# EAGLE schematic Main (EAGLE 7.5.0)
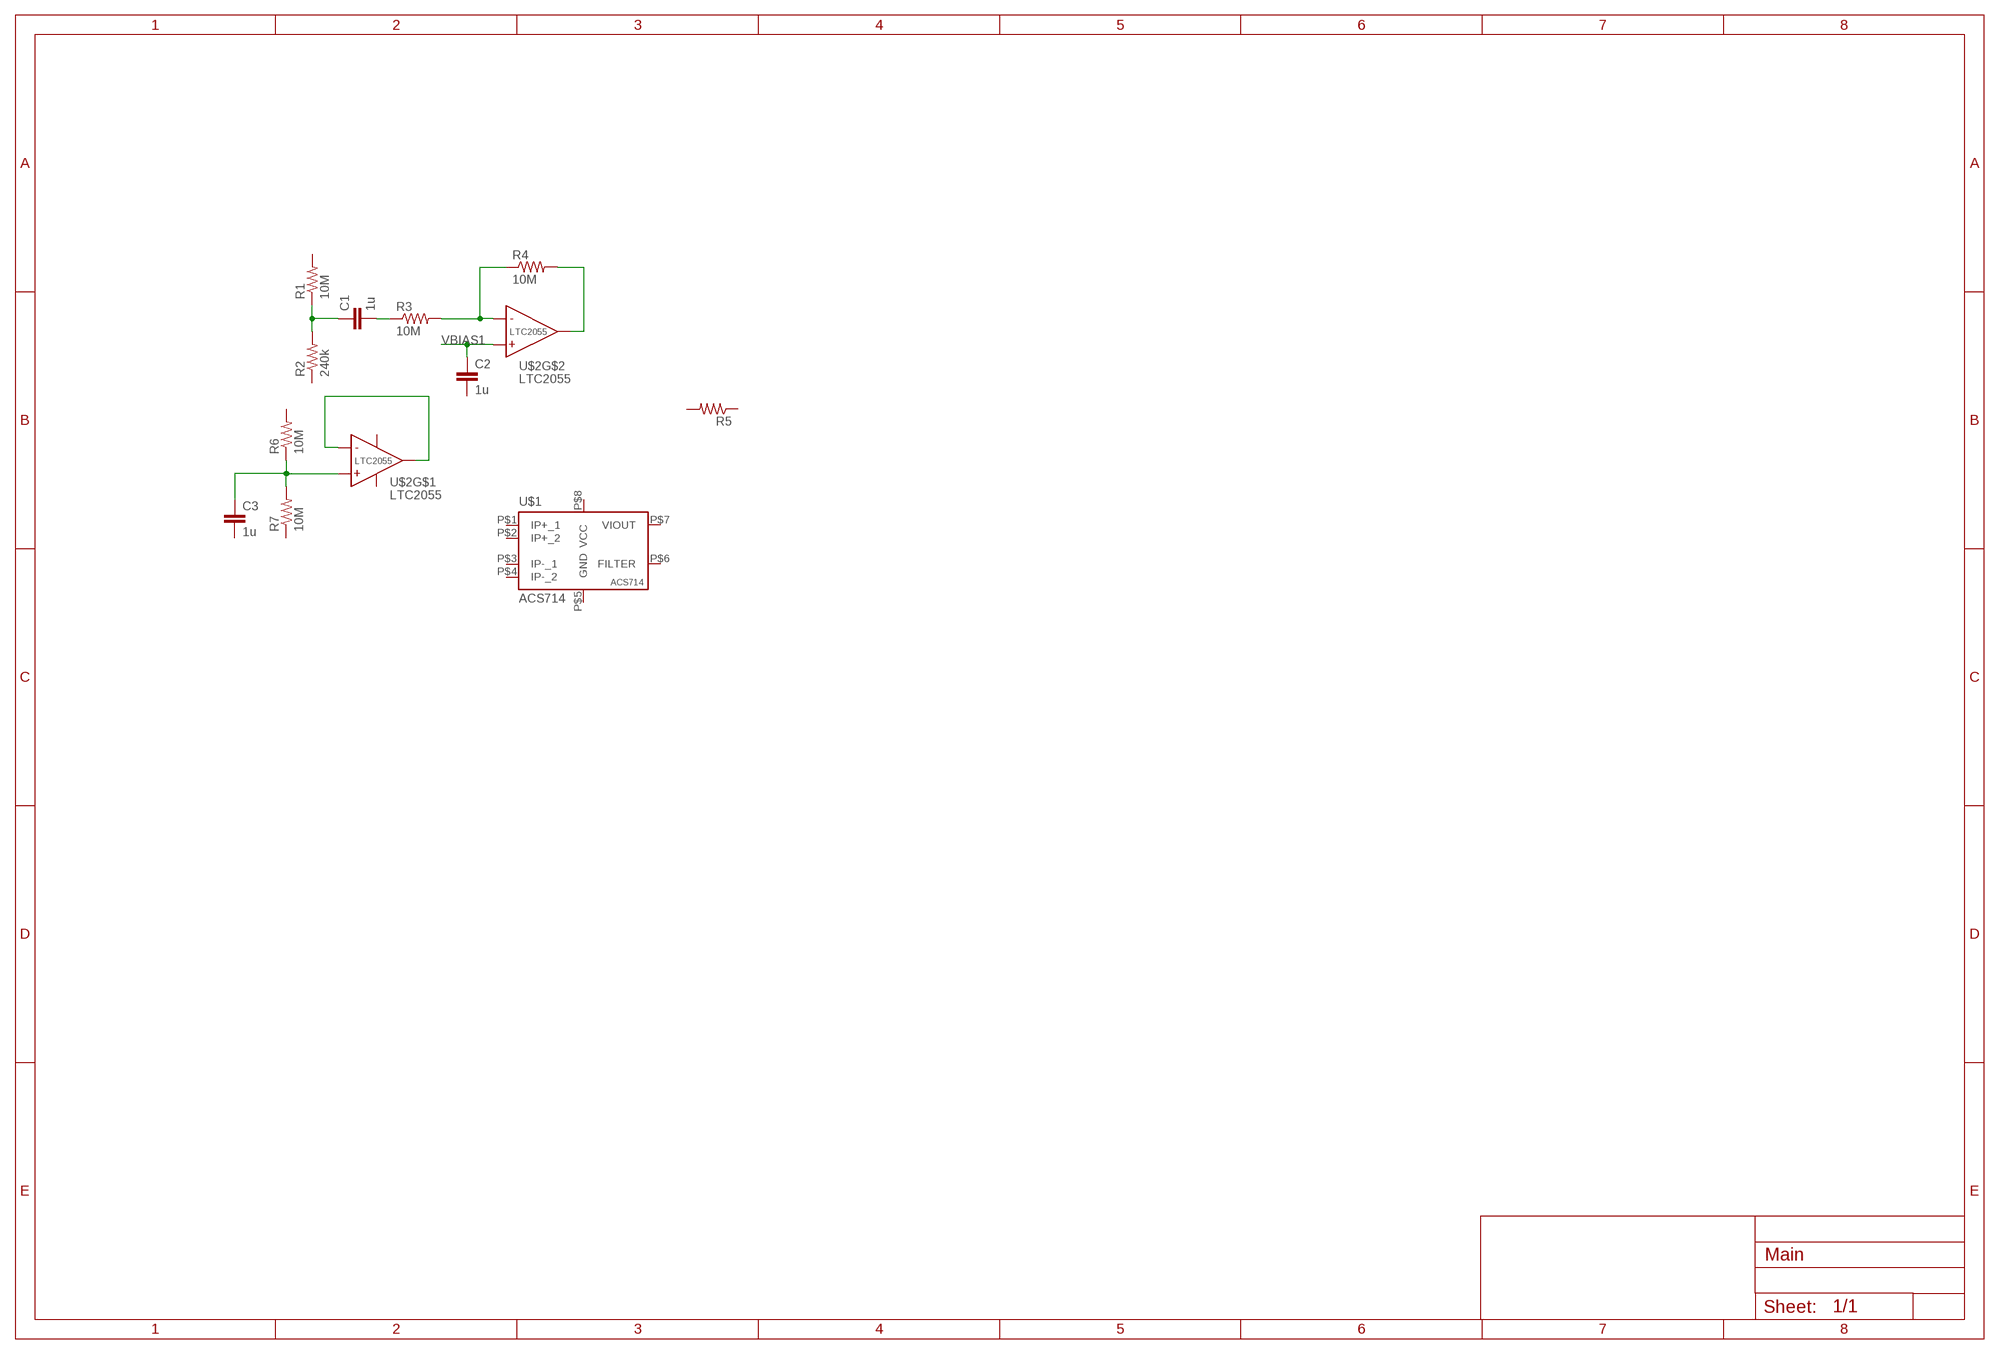
[diagram p0: schematic, sheet 1]

## Parts
C1  1u  C-EUC0805  [C0805]
C2  1u  C-EUC0805  [C0805]
C3  1u  C-EUC0805  [C0805]
R1  10M  R-US_R0805  [R0805]
R2  240k  R-US_R0805  [R0805]
R3  10M  R-US_R0805  [R0805]
R4  10M  R-US_R0805  [R0805]
R5  R-US_R0805  [R0805]
R6  10M  R-US_R0805  [R0805]
R7  10M  R-US_R0805  [R0805]
U$1  ACS714  [8SOIC-ACS714]
U$2  LTC2055  [MSOP8-LTC2055]

## Nets
N$1: C1.1 R1.1 R2.2
N$2: C1.2 R3.1
N$3: R3.2 R4.1 U$2.P$6(INM)
N$4: R4.2 U$2.P$7(OUT)
N$5: C3.1 R6.1 R7.2 U$2.P$3(INP)
N$6: U$2.P$1(OUT) U$2.P$2(INM)
VBIAS1: C2.1 U$2.P$5(INP)
Unconnected: C2.2 C3.2 R1.2 R2.1 R5.1 R5.2 R6.2 R7.1 U$1.P$1(IP+_1) U$1.P$2(IP+_2) U$1.P$3(IP-_1) U$1.P$4(IP-_2) U$1.P$5(GND) U$1.P$6(FILTER) U$1.P$7(VIOUT) U$1.P$8(VCC) U$2.P$4(VSS) U$2.P$8(VDD)

## Library data of the parts
C1-C3 = resistor:C-EU: CAPACITOR, European symbol
R1-R7 = resistor:R-US_: RESISTOR, American symbol
U$1 = TORO:ACS714
U$2 = TORO:LTC2055